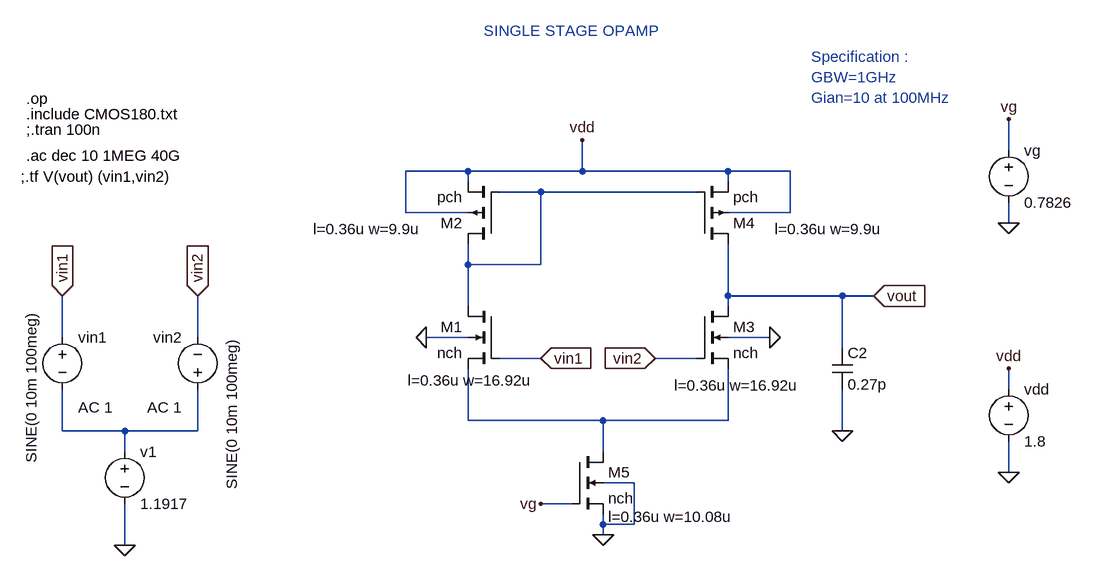
[diagram p0: schematic single stage opmap.asc]
single stage opmap.asc, the LTspice schematic file:
Version 4
SHEET 1 1088 756
WIRE 832 96 832 48
WIRE 0 128 -96 128
WIRE 176 128 176 80
WIRE 176 128 0 128
WIRE 400 128 176 128
WIRE 496 128 400 128
WIRE 0 144 0 128
WIRE 400 144 400 128
WIRE 112 160 48 160
WIRE 352 160 112 160
WIRE -96 192 -96 128
WIRE 0 192 -96 192
WIRE 496 192 496 128
WIRE 496 192 400 192
WIRE 832 208 832 176
WIRE 0 272 0 240
WIRE 112 272 112 160
WIRE 112 272 0 272
WIRE 400 320 400 240
WIRE 576 320 400 320
WIRE 624 320 576 320
WIRE 0 336 0 272
WIRE 400 336 400 320
WIRE -624 384 -624 320
WIRE -416 384 -416 320
WIRE 0 384 -64 384
WIRE 464 384 400 384
WIRE 576 400 576 320
WIRE 112 416 48 416
WIRE 352 416 288 416
WIRE 832 464 832 432
WIRE 0 512 0 432
WIRE 208 512 0 512
WIRE 400 512 400 432
WIRE 400 512 208 512
WIRE -624 528 -624 464
WIRE -528 528 -624 528
WIRE -416 528 -416 464
WIRE -416 528 -528 528
WIRE 576 528 576 464
WIRE -528 560 -528 528
WIRE 208 560 208 512
WIRE 832 592 832 544
WIRE 256 608 208 608
WIRE 160 640 112 640
WIRE 208 672 208 656
WIRE 256 672 256 608
WIRE 256 672 208 672
WIRE 208 688 208 672
WIRE -528 704 -528 640
FLAG 176 80 vdd
FLAG 624 320 vout
IOPIN 624 320 In
FLAG 576 528 0
FLAG -528 704 0
FLAG -624 320 vin1
IOPIN -624 320 In
FLAG -416 320 vin2
IOPIN -416 320 In
FLAG 112 416 vin1
IOPIN 112 416 In
FLAG 288 416 vin2
IOPIN 288 416 In
FLAG 832 432 vdd
FLAG 832 592 0
FLAG 464 384 0
FLAG 208 688 0
FLAG 112 640 vg
FLAG 832 208 0
FLAG 832 48 vg
FLAG -64 384 0
DATAFLAG 400 320 ""
SYMBOL nmos4 48 336 M0
WINDOW 123 -52 114 Left 2
SYMATTR Value2 l=0.36u w=16.92u
SYMATTR InstName M1
SYMATTR Value nch
SYMBOL pmos4 48 240 R180
WINDOW 123 120 23 Left 2
SYMATTR Value2 l=0.36u w=9.9u
SYMATTR InstName M2
SYMATTR Value pch
SYMBOL nmos4 352 336 R0
WINDOW 123 -35 122 Left 2
SYMATTR Value2 l=0.36u w=16.92u
SYMATTR InstName M3
SYMATTR Value nch
SYMBOL cap 560 400 R0
SYMATTR InstName C2
SYMATTR Value 0.27p
SYMBOL pmos4 352 240 M180
WINDOW 123 120 23 Left 2
SYMATTR Value2 l=0.36u w=9.9u
SYMATTR InstName M4
SYMATTR Value pch
SYMBOL voltage -528 544 R0
WINDOW 123 0 0 Left 0
WINDOW 39 0 0 Left 0
SYMATTR InstName v1
SYMATTR Value 1.1917
SYMBOL voltage -624 368 R0
WINDOW 3 -48 -25 VRight 2
WINDOW 123 24 124 Left 2
WINDOW 39 0 0 Left 0
SYMATTR Value SINE(0 10m 100meg)
SYMATTR Value2 AC 1
SYMATTR InstName vin1
SYMBOL voltage -416 480 R180
WINDOW 0 24 96 Left 2
WINDOW 3 -53 -138 VRight 2
WINDOW 123 24 -12 Left 2
WINDOW 39 0 0 Left 0
SYMATTR InstName vin2
SYMATTR Value SINE(0 10m 100meg)
SYMATTR Value2 AC 1
SYMBOL voltage 832 448 R0
WINDOW 123 0 0 Left 0
WINDOW 39 0 0 Left 0
SYMATTR InstName vdd
SYMATTR Value 1.8
SYMBOL nmos4 160 560 R0
WINDOW 123 56 100 Left 2
SYMATTR Value2 l=0.36u w=10.08u
SYMATTR InstName M5
SYMATTR Value nch
SYMBOL voltage 832 80 R0
WINDOW 123 0 0 Left 0
WINDOW 39 0 0 Left 0
SYMATTR InstName vg
SYMATTR Value 0.7826
TEXT -680 40 Left 2 !.include CMOS180.txt
TEXT -680 16 Left 2 !.op
TEXT -688 136 Left 2 !;.tf V(vout) (vin1,vin2)
TEXT -680 64 Left 2 !;.tran 100n
TEXT -680 104 Left 2 !.ac dec 10 1MEG 40G
TEXT 24 -88 Left 2 ;SINGLE STAGE OPAMP
TEXT 528 -48 Left 2 ;Specification :\nGBW=1GHz\nGian=10 at 100MHz

The netlist it stands for:
* single stage opmap.asc
M1 N001 vin1 N002 0 nch l=0.36u w=16.92u
M2 N001 N001 vdd vdd pch l=0.36u w=9.9u
M3 vout vin2 N002 0 nch l=0.36u w=16.92u
C2 vout 0 0.27p
M4 vout N001 vdd vdd pch l=0.36u w=9.9u
v1 N003 0 1.1917
vin1 vin1 N003 SINE(0 10m 100meg) AC 1
vin2 N003 vin2 SINE(0 10m 100meg) AC 1
vdd vdd 0 1.8
M5 N002 vg 0 0 nch l=0.36u w=10.08u
vg vg 0 0.7826
.model NMOS NMOS
.model PMOS PMOS
.lib standard.mos
.include CMOS180.txt
.op
;.tf V(vout) (vin1,vin2)
;.tran 100n
.ac dec 10 1MEG 40G
* SINGLE STAGE OPAMP
* Specification :
* GBW=1GHz
* Gian=10 at 100MHz
.backanno
.end